# Altium project DiPHO.PrjPcb
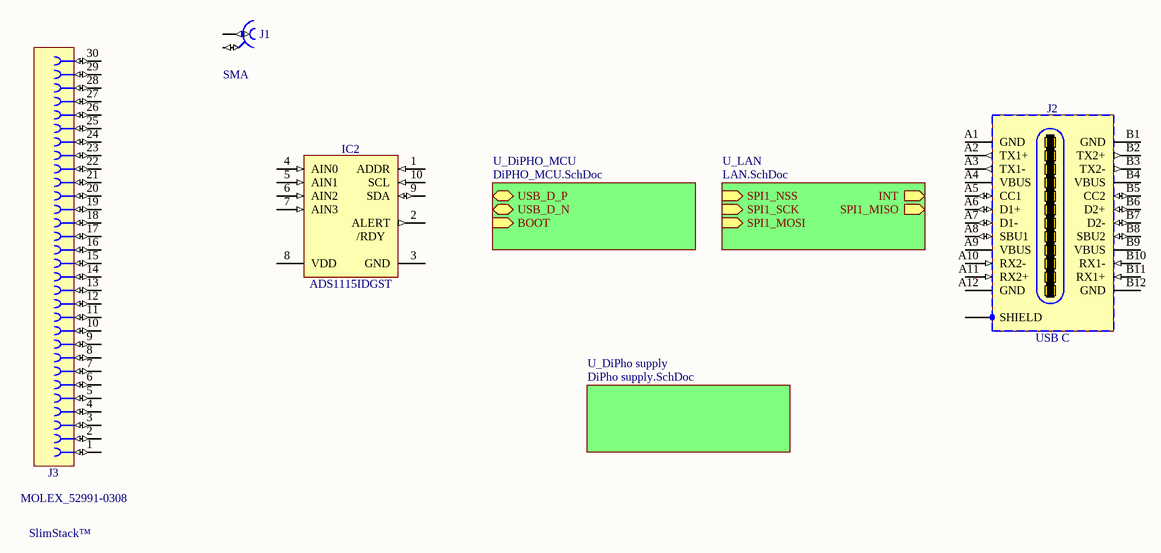
[diagram p0: DiPho_main.SchDoc]
4 sheets, 59 parts. Net scope: hierarchical (ports join the sheet entries above them; power ports are global).
Board file: DiPho.PcbDoc
Sheets:
  DiPho_main.SchDoc
    U_DiPHO_MCU = DiPHO_MCU.SchDoc
    U_LAN = LAN.SchDoc
    U_DiPho supply = DiPho supply.SchDoc

## Sheet DiPho_main.SchDoc
size A4

### Parts
IC2  ADS1115IDGST  [SOP50P490X110-10N]
J1  SMA  [AMPHENOL_132134]
J2  USB C  [AMPHENOL_10132328-10011LF]
J3  SlimStack™  [MOLEX_52991-0308]

### Sub-sheets
U_DiPho supply = DiPho supply.SchDoc: no entries
U_DiPHO_MCU = DiPHO_MCU.SchDoc: USB_D_P (bidir), USB_D_N (bidir), BOOT (in)
U_LAN = LAN.SchDoc: INT (out), SPI1_NSS (in), SPI1_SCK (in), SPI1_MOSI (in), SPI1_MISO (out)

### Nets

Not connected (* = marked no-connect by the designer): IC2 1(ADDR) 2(ALERT) 3(GND) 4(AIN0) 5(AIN1) 6(AIN2) 7(AIN3) 8(VDD) 9(SDA) 10(SCL); J1 1 2; J2 A1(GND) A2(TX1+) A3(TX1-) A4(VBUS) A5(CC1) A6(D1+) A7(D1-) A8(SBU1) A9(VBUS) A10(RX2-) A11(RX2+) A12(GND) B1(GND) B2(TX2+) B3(TX2-) B4(VBUS) B5(CC2) B6(D2+) B7(D2-) B8(SBU2) B9(VBUS) B10(RX1-) B11(RX1+) B12(GND) SHIELD; J3 1 2 3 4 5 6 7 8 9 10 11 12 13 14 15 16 17 18 19 20 21 22 23 24 25 26 27 28 29 30

### Notes on the sheet
- (in symbol ADS1115IDGST) /RDY

### Library data of the parts
IC2 = ADS1115IDGST: Ultra-Small, Low-Power, 16-Bit Analog-to-Digital Converter with Internal Reference; Part Description: Ultra-Small, Low-Power, 4 Channels 16-Bit Analog-to-Digital Converter with Internal Reference; Manufacturer: TEXAS INSTRUMENTS; PressFit: No; Bonding: No; Part Number: ADS1115IDGST; Component Kind: Standard; Component Type: Standard; Device: ADS1115IDGST; PackageDescription: SOP, 0.50mm Pitch; 10 Pin, 3.00mm W X 3.00mm L X 1.10mm H body, IPC Medium Density; Manufacturer Part Number: ADS1115IDGST; Pin Count: 10; Case: MSOP10; Mounted: Yes; Socket: No; SMD: Yes; Sense: No; ComponentHeight: 1.1mm; Author: CERN DEM JLC; HelpURL: \\cern.ch\dfs\Applications\Altium\Datasheets\ADS1115IDGST.pdf; CreateDate: 29.10.2012; LatestRevisionDate: 29.10.2012
J1 = AMPHENOL_132134: Part Description: 50 Ohm Through Hole SMA Straight PCB Jack; Manufacturer Part Number: 132134; PressFit: No; Part Number: AMPHENOL_132134; Component Kind: Standard; Component Type: Standard; Pin Count: 4; Family: SMA; Mounted: Yes; Socket: No; SMD: No; Sense: No; Status: None; Manufacturer: AMPHENOL; ComponentHeight: 9.53mm; HelpURL: \\cern.ch\dfs\Applications\Altium\Datasheets\AMPHENOL_132134.pdf; Author: CERN DEM JLC; CreateDate: 16.12.2013; LatestRevisionDate: 16.12.2013
J2 = AMPHENOL_10132328-10011LF: 2x12 Pin + 1 Shield  USB Type C Receptacle; Part Description: 1 Port Vertical Receptacle 24 Contacts, USB Type C Input Output Connector; PressFit: No; Part Number: AMPHENOL_10132328-10011LF; Component Kind: Standard; Component Type: Standard; Pin Count: 34; Family: USB C; Mounted: Yes; Socket: No; SMD: Yes; Sense: No; Status: None; Manufacturer: AMPHENOL; Manufacturer Part Number: 10132328-10011LF; ComponentHeight: 8.8mm; HelpURL: \\cern.ch\dfs\Applications\Altium\Datasheets\AMPHENOL_10132328-10011LF.pdf; Author: CERN DEM BC; CreateDate: 23.10.2020; LatestRevisionDate: 23.10.2020
J3 = MOLEX_52991-0308: Connector 30 Female; Part Description: 0.50mm Pitch SlimStack™ Dual Row 30 Circuits Surface Mount Vertical Receptacle (3.00 and 4.00mm Stacking Heights); Manufacturer: MOLEX; PressFit: No; Part Number: MOLEX_52991-0308; Component Kind: Standard; Component Type: Standard; Pin Count: 30; Family: SlimStack™; Mounted: Yes; Socket: No; SMD: Yes; Sense: No; Status: None; Manufacturer Part Number: 52991-0308; ComponentHeight: 2.27mm; HelpURL: \\cern.ch\dfs\Applications\Altium\Datasheets\MOLEX_52991-0308.pdf; Author: CERN DEM JLC; CreateDate: 28.08.2012; LatestRevisionDate: 28.08.2012

## Sheet DiPHO_MCU.SchDoc
size A3
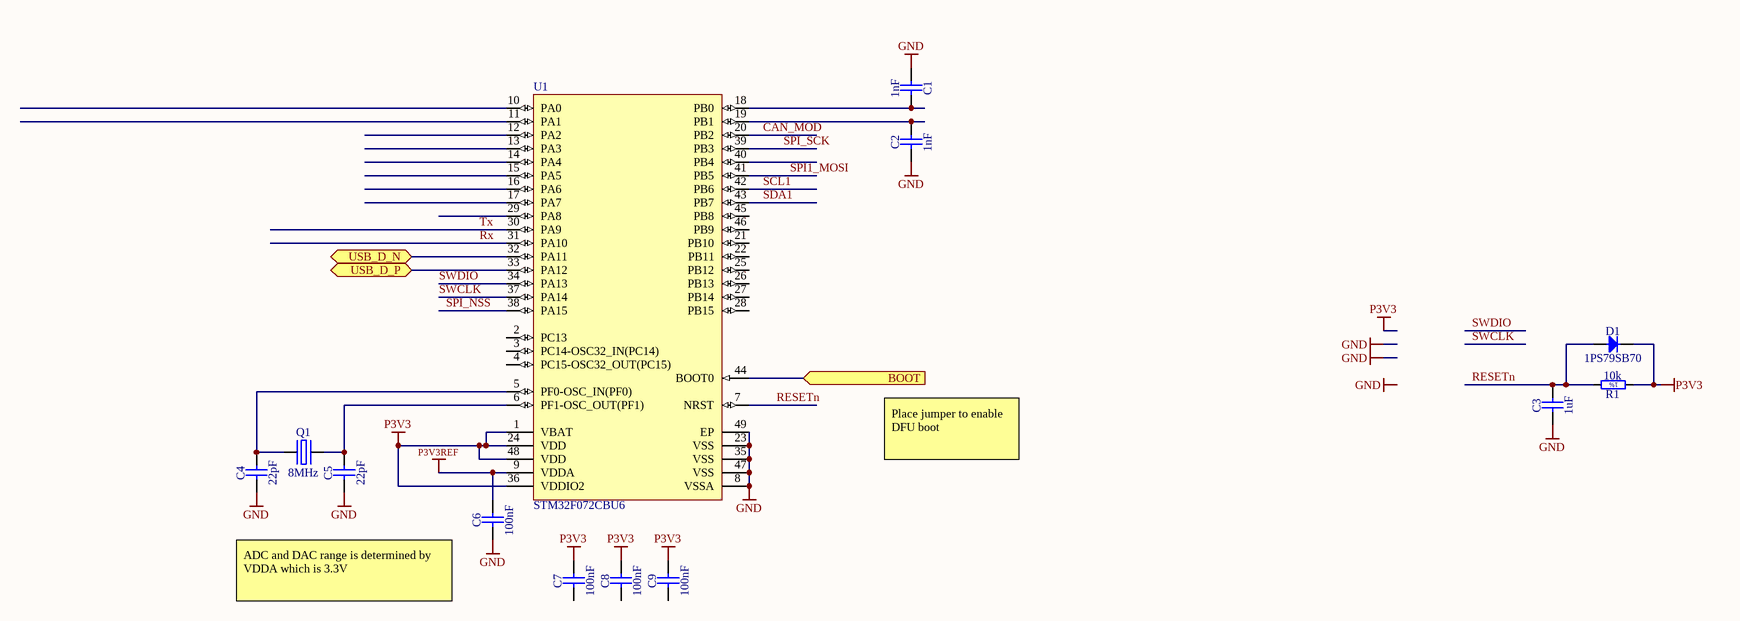
[diagram p1: DiPHO_MCU.SchDoc]

### Parts
C1  1nF  [CAPC1005X55N]
C2  1nF  [CAPC1005X55N]
C3  1uF  [CAPC1608X87N]
C4  22pF  [CAPC1005X55N]
C5  22pF  [CAPC1005X55N]
C6  100nF  [CAPC1005X55N]
C7  100nF  [CAPC1005X55N]
C8  100nF  [CAPC1005X55N]
C9  100nF  [CAPC1005X55N]
D1  1PS79SB70  [SODFL1608X65N]
Q1  8MHz  [XTAL_TXC_7A]
R1  10k  [RESC1005X40N]
U1  STM32F072CBU6  [STM-UFQFPN48_L]

### Ports
BOOT (in), USB_D_N (bidir), USB_D_P (bidir)

### Nets
GND: C1.1 C2.1 C3.1 C4.1 C5.1 C6.1 U1.8(VSSA) U1.23(VSS) U1.35(VSS) U1.47(VSS) U1.49(EP)
P3V3: C7.2 C8.2 C9.2 D1.1(C) R1.1 U1.1(VBAT) U1.24(VDD) U1.36(VDDIO2) U1.48(VDD)
P3V3REF: C6.2 U1.9(VDDA)
CAN_MOD: U1.20(PB2)
RESETn: C3.2 D1.2(A) R1.2 U1.7(NRST)
Rx: U1.31(PA10)
SCL1: U1.42(PB6)
SDA1: U1.43(PB7)
SPI1_MOSI: U1.41(PB5)
SPI_NSS: U1.38(PA15)
SPI_SCK: U1.39(PB3)
SWCLK: U1.37(PA14)
SWDIO: U1.34(PA13)
Tx: U1.30(PA9)
NetC1_2: C1.2 U1.18(PB0)
NetC2_2: C2.2 U1.19(PB1)
NetC4_2: C4.2 Q1.1(OSC1) U1.5(PF0-OSC_IN(PF0))
NetC5_2: C5.2 Q1.2(OSC2) U1.6(PF1-OSC_OUT(PF1))
NetU1_32: U1.32(PA11) ; port USB_D_N
NetU1_33: U1.33(PA12) ; port USB_D_P
NetU1_44: U1.44(BOOT0) ; port BOOT

Not connected (* = marked no-connect by the designer): C7 1; C8 1; C9 1; U1 2(PC13) 3(PC14-OSC32_IN(PC14)) 4(PC15-OSC32_OUT(PC15)) 10(PA0) 11(PA1) 12(PA2) 13(PA3) 14(PA4) 15(PA5) 16(PA6) 17(PA7) 21(PB10) 22(PB11) 25(PB12) 26(PB13) 27(PB14) 28(PB15) 29(PA8) 40(PB4) 45(PB8) 46(PB9)

### Notes on the sheet
- Place jumper to enable DFU boot
- ADC and DAC range is determined by VDDA which is 3.3V
- Labels drawn without touching a wire or pin: GND
- (in symbol R0402_10K_1%_0.0625W_100PPM) 1%

### Library data of the parts
C1 C2 = CC0402_1NF_50V_5%_C0G: Non-polarised capacitor; Part Description: SMD Multilayer Chip Ceramic Capacitor; Manufacturer: GENERIC; Manufacturer1 Part Number: C0402C102J5GACTU; Voltage: 50V; TC: C0G/NP0; Tolerance: ±5%; Part Number: CC0402_1NF_50V_5%_C0G; Component Kind: Standard; Component Type: Standard; Pin Count: 2; Value: 1nF; Status: Preferred; Manufacturer Part Number: CC0402_1NF_50V_5%_C0G; Case: 0402; Mounted: Yes; Socket: No; SMD: Yes; Sense: No; Manufacturer1 Example: KEMET; Manufacturer1 ComponentHeight: 0.55mm; HelpURL: \\cern.ch\dfs\Applications\Altium\Datasheets\CC0402_C0G_KEMET_(Commercial Grade).pdf; Author: CERN DEM BC; CreateDate: 02/09/2019; LatestRevisionDate: 02/09/2019
C3 = CC0603_1UF_16V_10%_X7R: Non-polarised capacitor; Part Description: SMD Multilayer Chip Ceramic Capacitor; Manufacturer: GENERIC; Manufacturer1 Part Number: 223878615663; Voltage: 16V; TC: X7R; Tolerance: ±10%; Part Number: CC0603_1UF_16V_10%_X7R; Component Kind: Standard; Component Type: Standard; Pin Count: 2; Value: 1uF; Status: None; Manufacturer Part Number: CC0603_1uF_16V_10%_X7R; Case: 0603; Mounted: Yes; Socket: No; SMD: Yes; Sense: No; Manufacturer1 Example: YAGEO PHYCOMP; Manufacturer1 ComponentHeight: 0.9mm; HelpURL: \\cern.ch\dfs\Applications\Altium\Datasheets\CC0603_X7R_PHYCOMP.pdf; Author: CERN DEM JLC; CreateDate: 03.12.2007; LatestRevisionDate: 17.04.2015
C4 C5 = CC0402_22PF_50V_5%_C0G: Non-polarised capacitor; Part Description: SMD Multilayer Chip Ceramic Capacitor; Manufacturer: GENERIC; Manufacturer1 Part Number: C0402C220J5GACTU; Voltage: 50V; TC: C0G/NP0; Tolerance: ±5%; Part Number: CC0402_22PF_50V_5%_C0G; Component Kind: Standard; Component Type: Standard; Pin Count: 2; Value: 22pF; Status: Preferred; Manufacturer Part Number: CC0402_22PF_50V_5%_C0G; Case: 0402; Mounted: Yes; Socket: No; SMD: Yes; Sense: No; Manufacturer1 Example: KEMET; Manufacturer1 ComponentHeight: 0.55mm; HelpURL: \\cern.ch\dfs\Applications\Altium\Datasheets\CC0805_C0G_KEMET_(Commercial Grade).pdf; Author: CERN DEM JLC; CreateDate: 03.12.2007; LatestRevisionDate: 03.12.2007
C6-C9 = CC0402_100NF_16V_10%_X7R: Non-polarised capacitor; Part Description: SMD Multilayer Chip Ceramic Capacitor; Manufacturer: GENERIC; Manufacturer1 Part Number: GRM155R71C104KA88D; Voltage: 16V; TC: X7R; Tolerance: ±10%; Part Number: CC0402_100NF_16V_10%_X7R; Component Kind: Standard; Component Type: Standard; Pin Count: 2; Value: 100nF; Status: Not Recommended; Manufacturer Part Number: CC0402_100NF_16V_10%_X7R; Case: 0402; Mounted: Yes; Socket: No; SMD: Yes; Sense: No; Manufacturer1 Example: MURATA; Manufacturer1 ComponentHeight: 0.55mm; HelpURL: \\cern.ch\dfs\Applications\Altium\Datasheets\CC0402_X7R_MURATA_GRM.pdf; Author: CERN DEM JLC; CreateDate: 05.12.2013; LatestRevisionDate: 03.12.2007
D1 = D_1PS79SB70: Diode; Part Description: High-speed switching diode; Manufacturer: NEXPERIA; Voltage: 70V; Power: 70mA; PressFit: No; Bonding: No; Part Number: 1PS79SB70; Component Kind: Standard; Component Type: Standard; Device: 1PS79SB70; PackageDescription: Ultra Small Outline Diode Flat Lead (SOD-523), Body; 1.2mm L X 0.8mm W X 0.65mm H, IPC Medium Density; Manufacturer Part Number: 1PS79SB70; Pin Count: 2; Case: SOD523; Mounted: Yes; Socket: No; SMD: Yes; Sense: No; ComponentHeight: 0.65mm; HelpURL: \\cern.ch\dfs\Applications\Altium\Datasheets\BAS516.pdf; Author: GK; CreateDate: 11/09/2018; LatestRevisionDate: 11/09/2018
Q1 = XTAL_8MHZ_TXC_7A-8.000MAAE-T: Quartz Crystal; Part Description: Tolerance: ±30ppm, Stability: ±30ppm, -20°C to +70°C, 12pF, SMD Glass Seam Sealing Crystal, 7A Series; Manufacturer: TXC CORPORATION; PressFit: No; Bonding: No; Part Number: XTAL_8MHZ_TXC_7A-8.000MAAE-T; Component Kind: Standard; Component Type: Standard; PackageDescription: 2 Pins, 3.2x5mm, SMD Glass Seam Sealing Crystal, 7A Serie; Value: 8MHz; Manufacturer Part Number: 7A-8.000MAAE-T; Pin Count: 2; Mounted: Yes; Socket: No; SMD: Yes; Sense: No; ComponentHeight: 1.2mm; HelpURL: \\cern.ch\dfs\Applications\Altium\Datasheets\XTAL_TXC_7A.pdf; Author: CERN DEM JLC; CreateDate: 09.10.2014; LatestRevisionDate: 12.11.2014
R1 = R0402_10K_1%_0.0625W_100PPM: Resistor - 1%; Part Description: General Purpose Thick Film Chip Resistor; Manufacturer: GENERIC; Manufacturer1 Part Number: 232270671003L; TC: ±100ppm/°C; PressFit: No; Part Number: R0402_10K_1%_0.0625W_100PPM; Component Kind: Standard; Component Type: Standard; Pin Count: 2; Value: 10k; Status: Not Recommended; Power: 0.0625W; Tolerance: ±1%; Manufacturer Part Number: R0402_10K_1%_0.0625W_100PPM; Case: 0402; Mounted: Yes; Sense: No; Socket: No; SMD: Yes; Manufacturer1 Example: YAGEO PHYCOMP; Manufacturer1 ComponentHeight: 0.4mm; HelpURL: \\cern.ch\dfs\Applications\Altium\Datasheets\R0402_Phycomp_RC0402.pdf; Author: CERN DEM JLC; CreateDate: 03.12.2007; LatestRevisionDate: 17.10.2012
U1 = CMP-0304-00173-2: ARM Cortex-M0 32-bit MCU, 128 KB Flash, 16 KB Internal RAM, 37 I/Os, 48-Pin UFQFPN, -40 to 85 degC, Tray; Manufacturer: STMicroelectronics; I/Os (High Current): 37; FLASH Size (Prog) (kB): 128; Supply Voltage(Vcc) min (V): 2; Internal RAM Size (kB): 16; D/A Converter: 1; Operating Frequency(F) (Processor speed) (MHz): 48; Package Reference: UFQFPN48; ComponentLink2Description: Datasheet; ComponentLink2URL: http://www.st.com/st-web-ui/static/active/en/resource/technical/document/datasheet/DM00090510.pdf; Package Description: 48-Pin Ultra Thin Fine Pitch Quad Flat No-Lead, 7 x 7 x 0.6 mm Body, 0.5 mm Pitch, Exposed Pad; Mounting Technology: Surface Mount; Packing: Tray; ComponentLink1URL: http://www.st.com/; ComponentLink1Description: Manufacturer URL; DatasheetVersion: Rev. 5; PartNumber: STM32F072CBU6; Core: ARM Cortex-M0

## Sheet LAN.SchDoc
size A4
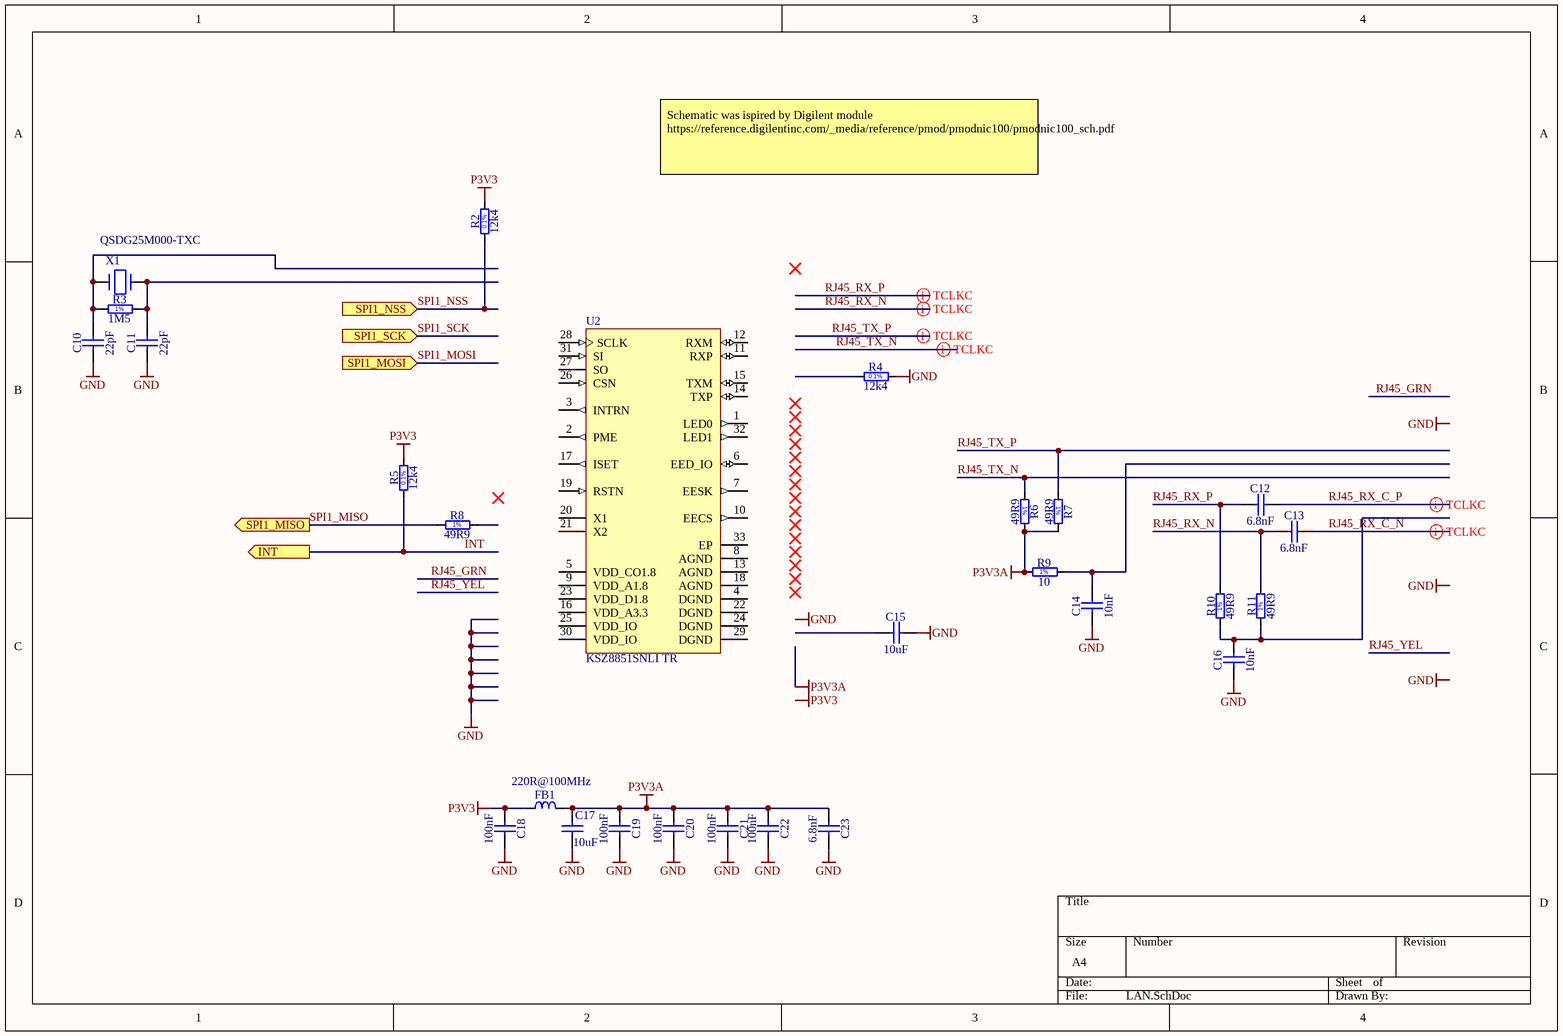
[diagram p2: LAN.SchDoc]

### Parts
C10  22pF  [CAPC1005X55N]
C11  22pF  [CAPC1005X55N]
C12  6.8nF  [CAPC1608X87N]
C13  6.8nF  [CAPC1608X87N]
C14  10nF  [CAPC1608X87N]
C15  10uF  [CAPC1608X80N]
C16  10nF  [CAPC1608X87N]
C17  10uF  [CAPC2012X135N]
C18  100nF  [CAPC1005X55N]
C19  100nF  [CAPC1005X55N]
C20  100nF  [CAPC1005X55N]
C21  100nF  [CAPC1005X55N]
C22  100nF  [CAPC1005X55N]
C23  6.8nF  [CAPC1608X87N]
FB1  220R@100MHz  [INDC2012X105N]
R2  12k4  [RESC1608X55N]
R3  1M5  [RESC1005X40N]
R4  12k4  [RESC1608X55N]
R5  12k4  [RESC1608X55N]
R6  49R9  [RESC1005X40N]
R7  49R9  [RESC1005X40N]
R8  49R9  [RESC1005X40N]
R9  10  [RESC1005X40N]
R10  49R9  [RESC1005X40N]
R11  49R9  [RESC1005X40N]
U2  KSZ8851SNLI TR  [MCHP-MLF-32_L]
X1  QSDG25M000-TXC  [XTAL_5.0*3.2]

### Ports
INT (out), SPI1_MISO (out), SPI1_MOSI (in), SPI1_NSS (in), SPI1_SCK (in)

### Nets
GND: C10.1 C11.1 C14.1 C15.2 C16.1 C17.2 C18.2 C19.2 C20.2 C21.2 C22.2 C23.2 R4.2
P3V3: C18.1 FB1.1 R2.2 R5.2
P3V3A: C17.1 C19.1 C20.1 C21.1 C22.1 C23.1 FB1.2 R6.2 R7.2 R9.1
INT: R5.1 ; port INT
RJ45_RX_C_N: C13.2
RJ45_RX_C_P: C12.2
RJ45_RX_N: C13.1 R11.2
RJ45_RX_P: C12.1 R10.2
RJ45_TX_N: R6.1
RJ45_TX_P: R7.1
SPI1_MISO: R8.1 ; port SPI1_MISO
SPI1_MOSI: port SPI1_MOSI
SPI1_NSS: R2.1 ; port SPI1_NSS
SPI1_SCK: port SPI1_SCK
NetC10_2: C10.2 R3.1 X1.1
NetC11_2: C11.2 R3.2 X1.2
NetC14_2: C14.2 R9.2
NetC16_2: C16.2 R10.1 R11.1

Not connected (* = marked no-connect by the designer): C15 1; R4 1; R8 2; U2 1(LED0) 2(PME) 3(INTRN) 4(DGND) 5(VDD_CO1.8) 6(EED_IO) 7(EESK) 8(AGND) 9(VDD_A1.8) 10(EECS) 11(RXP) 12(RXM) 13(AGND) 14(TXP) 15(TXM) 16(VDD_A3.3) 17(ISET) 18(AGND) 19(RSTN) 20(X1) 21(X2) 22(DGND) 23(VDD_D1.8) 24(DGND) 25(VDD_IO) 26(CSN) 27(SO) 28(SCLK) 29(DGND) 30(VDD_IO) 31(SI) 32(LED1) 33(EP)

### Layout directives
differential pair: RJ45_RX_C_N, RJ45_RX_C_P, RJ45_RX_N, RJ45_RX_P, RJ45_TX_N, RJ45_TX_P

### Notes on the sheet
- Schematic was ispired by Digilent module https://reference.digilentinc.com/_media/reference/pmod/pmodnic100/pmodnic100_sch.pdf
- Labels drawn without touching a wire or pin: GND, P3V3
- (in symbol R0402_1M5_1%_0.0625W_100PPM) 1%
- (in symbol R0402_10R_1%_0.0625W_200PPM) 1%
- (in symbol R0402_49R9_1%_0.0625W_100PPM) 1%
- (in symbol R0603_12K4_0.1%_0.063W_10PPM) 0.1%

### Library data of the parts
C10 C11 = CC0402_22PF_50V_5%_NP0: Non-polarised capacitor; Part Description: SMD Multilayer Chip Ceramic Capacitor; Manufacturer: GENERIC; Manufacturer1 Part Number: 223886915229; Voltage: 50V; TC: NP0; Tolerance: ±5%; Table: Capacitors SMD; Part Number: CC0402_22PF_50V_5%_NP0; Component Kind: Standard; Component Type: Standard; Pin Count: 2; Value: 22pF; Status: Not Recommended; Manufacturer Part Number: CC0402_22PF_50V_5%_NP0; Case: 0402; Mounted: Yes; Socket: No; SMD: Yes; Manufacturer1 Example: PHYCOMP; Manufacturer1 ComponentHeight: 0.55mm; HelpURL: \\cern.ch\dfs\Applications\Altium\Datasheets\CC0402_NP0_PHYCOMP.pdf; Author: CERN DEM JLC; CreateDate: 2007-12-03; LatestRevisionDate: 2007-12-03
C12 C13 C23 = CC0603_6.8NF_25V_1%_C0G: Non-polarised capacitor; Part Description: SMD Multilayer Chip Ceramic Capacitor; Manufacturer: GENERIC; Manufacturer1 Part Number: C0603C682F3GACTU; Voltage: 25V; TC: C0G/NP0; Tolerance: ±1%; Part Number: CC0603_6.8NF_25V_1%_C0G; Component Kind: Standard; Component Type: Standard; Pin Count: 2; Value: 6.8nF; Status: None; Manufacturer Part Number: CC0603_6.8NF_25V_1%_C0G; Case: 0603; Mounted: Yes; Socket: No; SMD: Yes; Sense: No; Manufacturer1 Example: KEMET; Manufacturer1 ComponentHeight: 0.87mm; HelpURL: \\cern.ch\dfs\Applications\Altium\Datasheets\CC0603_C0G_KEMET_(Commercial Grade).pdf; Author: CERN DEM JLC; CreateDate: 23/05/2018; LatestRevisionDate: 23/05/2018
C14 C16 = CC0603_10NF_50V_5%_C0G: Non-polarised capacitor; Part Description: SMD Multilayer Chip Ceramic Capacitor; Manufacturer: GENERIC; Manufacturer1 Part Number: C1608C0G1H103J080AA; Voltage: 50V; TC: C0G/NP0; Tolerance: ±5%; Part Number: CC0603_10NF_50V_5%_C0G; Component Kind: Standard; Component Type: Standard; Pin Count: 2; Value: 10nF; Status: Preferred; Manufacturer Part Number: CC0603_10NF_50V_5%_C0G; Case: 0603; Mounted: Yes; Socket: No; SMD: Yes; Sense: No; Manufacturer1 Example: TDK; Manufacturer1 ComponentHeight: 0.9mm; HelpURL: \\cern.ch\dfs\Applications\Altium\Datasheets\CC0603_C0G_TDK_C.pdf; Author: CERN DEM JLC; CreateDate: 10.12.2014; LatestRevisionDate: 10.12.2014
C15 = CC0603_10UF_16V_20%_X5R: Non-polarised capacitor; Part Description: SMD Multilayer Chip Ceramic Capacitor; Manufacturer: GENERIC; Manufacturer1 Part Number: GRM188R61C106MA73D; Voltage: 16V; TC: X5R; Tolerance: ±20%; Part Number: CC0603_10UF_16V_20%_X5R; Component Kind: Standard; Component Type: Standard; Pin Count: 2; Value: 10uF; Status: None; Manufacturer Part Number: CC0603_10UF_16V_20%_X5R; Case: 0603; Mounted: Yes; Socket: No; SMD: Yes; Sense: No; Manufacturer1 Example: MURATA; Manufacturer1 ComponentHeight: 0.8mm; HelpURL: \\cern.ch\dfs\Applications\Altium\Datasheets\CC0603_X5R_MURATA_GRM.pdf; Author: CERN DEM MR; CreateDate: 02/03/2016; LatestRevisionDate: 02/03/2016
C17 = CC0805_10UF_10V_10%_X7R: Non-polarised capacitor; Part Description: SMD Multilayer Chip Ceramic Capacitor; Manufacturer: GENERIC; Manufacturer1 Part Number: GRM21BR71A106KE51L; Voltage: 10V; TC: X7R; Tolerance: ±10%; Table: Capacitors SMD; Part Number: CC0805_10UF_10V_10%_X7R; Component Kind: Standard; Component Type: Standard; Pin Count: 2; Value: 10uF; Status: Preferred; Manufacturer Part Number: CC0805_10UF_10V_10%_X7R; Case: 0805; Mounted: Yes; Socket: No; SMD: Yes; Manufacturer1 Example: MURATA; Manufacturer1 ComponentHeight: 1.35mm; HelpURL: \\cern.ch\dfs\Applications\Altium\Datasheets\CC0805_X7R_MURATA.pdf; Author: CERN DEM JLC; CreateDate: 2012-04-30; LatestRevisionDate: 2012-04-30
C18-C22 = CC0402_100NF_16V_10%_X7R: as C6 on sheet DiPHO_MCU; Part Number: CC0402_100NF_16V_10%_X7R; Component Kind: Standard; Component Type: Standard; Pin Count: 2; Value: 100nF; Status: Not Recommended; Manufacturer Part Number: CC0402_100NF_16V_10%_X7R; Case: 0402; Mounted: Yes; Socket: No; SMD: Yes; Manufacturer1 Example: MURATA; Manufacturer1 ComponentHeight: 0.55mm; HelpURL: \\cern.ch\dfs\Applications\Altium\Datasheets\CC0402_X7R_MURATA_GRM.pdf; Author: CERN DEM JLC; CreateDate: 05.12.2013; LatestRevisionDate: 03.12.2007; Sense: No
FB1 = IND0805_MURATA_BLM21PG221SN1D: Inductor; Part Description: SMD EMIFIL Suppression Chip Ferrite Bead; Manufacturer: MURATA; Power: 2A; Resistance: 0.05R; Tolerance: ±25%; Table: Inductors SMD; Part Number: IND0805_MURATA_BLM21PG221SN1D; Component Kind: Standard; Component Type: Standard; Pin Count: 2; Value: 220R@100MHz; Status: None; Manufacturer Part Number: BLM21PG221SN1D; Case: 0805; Mounted: Yes; Socket: No; SMD: Yes; ComponentHeight: 1.05mm; HelpURL: \\cern.ch\dfs\Applications\Altium\Datasheets\IND0402_MURATA_BLM21P.pdf; Author: CERN DEM JLC; CreateDate: 2010-01-25; LatestRevisionDate: 2010-01-25
R2 R4 R5 = R0603_12K4_0.1%_0.063W_10PPM: Resistor - 0.1%; Part Description: Thin Film Chip Resistor; Manufacturer: GENERIC; Manufacturer1 Part Number: RN73C1J12K4BTDF; Power: 0.063W; TC: ±10ppm; Part Number: R0603_12K4_0.1%_0.063W_10PPM; Component Kind: Standard; Component Type: Standard; Pin Count: 2; Value: 12k4; Status: Not recommended; Tolerance: ±0.1%; Manufacturer Part Number: R0603_12K4_0.1%_0.063W_10PPM; Case: 0603; Mounted: Yes; Sense: No; Socket: No; SMD: Yes; Manufacturer1 Example: TYCO HOLSWORTHY; Manufacturer1 ComponentHeight: 0.5mm; HelpURL: \\cern.ch\dfs\Applications\Altium\Datasheets\R0603_Tyco_RN73.pdf; Author: CERN DEM JLC; CreateDate: 03.12.2007; LatestRevisionDate: 13.03.2008
R3 = R0402_1M5_1%_0.0625W_100PPM: Resistor - 1%; Part Description: General Purpose Thick Film Chip Resistor; Manufacturer: GENERIC; Manufacturer1 Part Number: 232270671505L; TC: ±100ppm/°C; PressFit: No; Part Number: R0402_1M5_1%_0.0625W_100PPM; Component Kind: Standard; Component Type: Standard; Pin Count: 2; Value: 1M5; Status: Not Recommended; Power: 0.0625W; Tolerance: ±1%; Manufacturer Part Number: R0402_1M5_1%_0.0625W_100PPM; Case: 0402; Mounted: Yes; Sense: No; Socket: No; SMD: Yes; Manufacturer1 Example: YAGEO PHYCOMP; Manufacturer1 ComponentHeight: 0.4mm; HelpURL: \\cern.ch\dfs\Applications\Altium\Datasheets\R0402_Phycomp_RC0402.pdf; Author: CERN DEM JLC; CreateDate: 03/12/2007; LatestRevisionDate: 17/10/2012
R6-R8 R10 R11 = R0402_49R9_1%_0.0625W_100PPM: Resistor - 1%; Part Description: General Purpose Thick Film Chip Resistor; Manufacturer: GENERIC; Manufacturer1 Part Number: 232270674999L or RC0402FR-0749R9L; TC: ±100ppm/°C; Table: Resistors SMD; Part Number: R0402_49R9_1%_0.0625W_100PPM; Component Kind: Standard; Component Type: Standard; Pin Count: 2; Value: 49R9; Status: Not recommended; Power: 0.0625W; Tolerance: ±1%; Manufacturer Part Number: R0402_49R9_1%_0.0625W_100PPM; Case: 0402; Mounted: Yes; Socket: No; SMD: Yes; Manufacturer1 Example: YAGEO PHYCOMP; Manufacturer1 ComponentHeight: 0.4mm; HelpURL: \\cern.ch\dfs\Applications\Altium\Datasheets\R0402_Phycomp_RC0402.pdf; Author: CERN DEM JLC; CreateDate: 2012-10-24; LatestRevisionDate: 2012-10-24
R9 = R0402_10R_1%_0.0625W_200PPM: Resistor - 1%; Part Description: General Purpose Thick Film Chip Resistor; Manufacturer: GENERIC; Manufacturer1 Part Number: 232270671009L; TC: ±200ppm/°C; Part Number: R0402_10R_1%_0.0625W_200PPM; Component Kind: Standard; Component Type: Standard; Pin Count: 2; Value: 10; Status: Not recommended; Power: 0.0625W; Tolerance: ±1%; Manufacturer Part Number: R0402_10R_1%_0.0625W_200PPM; Case: 0402; Mounted: Yes; Sense: No; Socket: No; SMD: Yes; Manufacturer1 Example: YAGEO PHYCOMP; Manufacturer1 ComponentHeight: 0.4mm; HelpURL: \\cern.ch\dfs\Applications\Altium\Datasheets\R0402_Phycomp_RC0402.pdf; Author: CERN DEM JLC; CreateDate: 24.06.2009; LatestRevisionDate: 17.10.2012
U2 = CMP-2000-06522-1: Single-Port Ethernet Controller with SPI Interface, 3.1 to 3.5 V, -40 to 85 degC, 32-Pin MLF, RoHS, Tape and Reel; Manufacturer: Micrel; Protocol Supported: 802.3; Number of Transceivers: 1Transceiver; Data Rate: 100Mbps; Maximum Supply Current: 85mA; Supply Voltage - Min: 3.1V; Ethernet Connection Type: 10/100Base-TX; Supply Voltage - Max: 3.5V; Package Description: 32-Pin Quad Flat No-lead Package, Body 5 x 5 mm, Thermal Pad 3.1 x 3.1 mm, Pitch 0.5 mm; Mounting Style: SMD/SMT; Series: KSZ8851; Manufacturer URL: http://www.microchip.com/; Minimum Operating Temperature: -40C; Packaging: Reel; Package Reference: MLF-32; Package / Case: MLF-32; Datasheet Version: 11/2016; Mounting Technology: SurfaceMount; Datasheet URL: http://ww1.microchip.com/downloads/en/DeviceDoc/00002381A.pdf; Product Category: EthernetICs; Maximum Operating Temperature: +85C; Product: EthernetControllers; RoHS: Details; Brand: Micrel; Factory Pack Quantity: 1000
X1 = X_CRYSTAL_SMD_5.0*3.2: miniature crystal oscillator (Maritex)

## Sheet DiPho supply.SchDoc
size A4
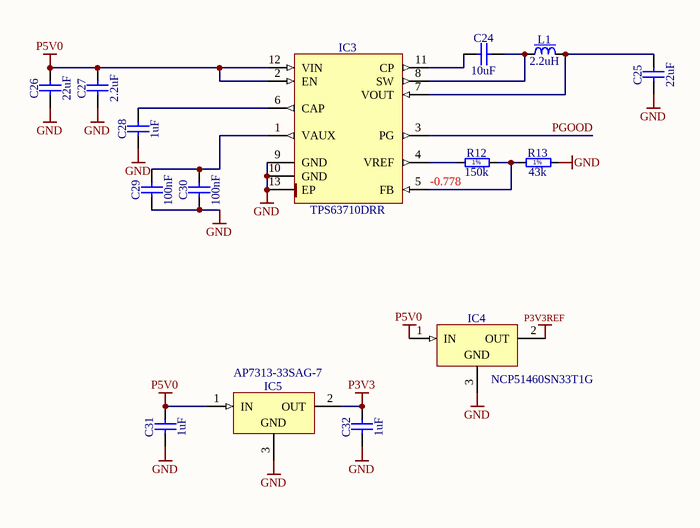
[diagram p3: DiPho supply.SchDoc]

### Parts
C24  10uF  [CAPC2012X135N]
C25  22uF  [CAPC2012X135N]
C26  22uF  [CAPC2012X135N]
C27  2.2uF  [CAPC1608X87N]
C28  1uF  [CAPC1608X87N]
C29  100nF  [CAPC1005X55N]
C30  100nF  [CAPC1005X55N]
C31  1uF  [CAPC1608X87N]
C32  1uF  [CAPC1608X87N]
IC3  TPS63710DRR  [SON50P300X300X80-13N-R160X260]
IC4  NCP51460SN33T1G  [SOT95P240X110-3N]
IC5  AP7313-33SAG-7  [SOT95P240X130-3N]
L1  2.2uH  [INDM3225X210N]
R12  150k  [RESC1005X40N]
R13  43k  [RESC1005X40N]

### Nets
GND: C25.1 C26.1 C27.1 C28.1 C29.1 C30.1 C31.1 C32.1 IC3.9(GND) IC3.10(GND) IC3.13(EP) IC4.3(GND) IC5.3(GND) R13.2
P3V3: C32.2 IC5.2(OUT)
P3V3REF: IC4.2(OUT)
P5V0: C26.2 C27.2 C31.2 IC3.2(EN) IC3.12(VIN) IC4.1(IN) IC5.1(IN)
PGOOD: IC3.3(PG)
NetC24_1: C24.1 IC3.11(CP)
NetC24_2: C24.2 IC3.8(SW) L1.1
NetC25_2: C25.2 IC3.7(VOUT) L1.2
NetC28_2: C28.2 IC3.6(CAP)
NetC29_2: C29.2 C30.2 IC3.1(VAUX)
NetIC3_4: IC3.4(VREF) R12.1
NetIC3_5: IC3.5(FB) R12.2 R13.1

### Notes on the sheet
- (near R12) -0.778
- (in symbol R0402_43K_1%_0.0625W_100PPM) 1%
- (in symbol R0402_150K_1%_0.0625W_100PPM) 1%

### Library data of the parts
C24 = CC0805_10UF_16V_10%_X5R: Non-polarised capacitor; Part Description: SMD Multilayer Chip Ceramic Capacitor; Manufacturer: GENERIC; Manufacturer1 Part Number: C0805C106K4PAC; Voltage: 16V; TC: X5R; Tolerance: ±10%; Part Number: CC0805_10UF_16V_10%_X5R; Component Kind: Standard; Component Type: Standard; Pin Count: 2; Value: 10uF; Status: Preferred; Manufacturer Part Number: CC0805_10UF_16V_10%_X5R; Case: 0805; Mounted: Yes; Socket: No; SMD: Yes; Sense: No; Manufacturer1 Example: KEMET; Manufacturer1 ComponentHeight: 1.4mm; HelpURL: \\cern.ch\dfs\Applications\Altium\Datasheets\CC1206_X5R_KEMET.pdf; Author: CERN DEM JLC; CreateDate: 03.12.2007; LatestRevisionDate: 03.12.2007
C25 C26 = CC0805_22UF_16V_10%_X5R: Non-polarised capacitor; Part Description: SMD Multilayer Chip Ceramic Capacitor; Manufacturer: GENERIC; Manufacturer1 Part Number: C2012X5R1C226KT; Voltage: 16V; TC: X5R; Tolerance: ±10%; Part Number: CC0805_22UF_16V_10%_X5R; Component Kind: Standard; Component Type: Standard; Pin Count: 2; Value: 22uF; Status: Preferred; Manufacturer Part Number: CC0805_22UF_16V_10%_X5R; Case: 0805; Mounted: Yes; Socket: No; SMD: Yes; Sense: No; Manufacturer1 Example: TDK; Manufacturer1 ComponentHeight: 1.35mm; HelpURL: \\cern.ch\dfs\Applications\Altium\Datasheets\CC0805_X5R_TDK_C.pdf; Author: CERN DEM JLC; CreateDate: 25.10.2012; LatestRevisionDate: 25.10.2012
C27 = CC0603_2.2UF_16V_10%_X5R: Non-polarised capacitor; Part Description: SMD Multilayer Chip Ceramic Capacitor; Manufacturer: GENERIC; Manufacturer1 Part Number: CC0603KRX5R7BB225; Voltage: 16V; TC: X5R; Tolerance: ±10%; Part Number: CC0603_2.2UF_16V_10%_X5R; Component Kind: Standard; Component Type: Standard; Pin Count: 2; Value: 2.2uF; Status: Preferred; Manufacturer Part Number: CC0603_2.2UF_16V_10%_X5R; Case: 0603; Mounted: Yes; Socket: No; SMD: Yes; Sense: No; Manufacturer1 Example: YAGEO; Manufacturer1 ComponentHeight: 0.9mm; HelpURL: \\cern.ch\dfs\Applications\Altium\Datasheets\CC0805_X5R_PHYCOMP_HC.pdf; Author: CERN DEM JLC; CreateDate: 28.04.2011; LatestRevisionDate: 28.04.2011
C28 C31 C32 = CC0603_1UF_16V_10%_X7R: as C3 on sheet DiPHO_MCU; Part Number: CC0603_1UF_16V_10%_X7R; Component Kind: Standard; Component Type: Standard; Pin Count: 2; Value: 1uF; Status: None; Manufacturer Part Number: CC0603_1uF_16V_10%_X7R; Case: 0603; Mounted: Yes; Socket: No; SMD: Yes; Sense: No; Manufacturer1 Example: YAGEO PHYCOMP; Manufacturer1 ComponentHeight: 0.9mm; HelpURL: \\cern.ch\dfs\Applications\Altium\Datasheets\CC0603_X7R_PHYCOMP.pdf; Author: CERN DEM JLC; CreateDate: 03.12.2007; LatestRevisionDate: 17.04.2015
C29 C30 = CC0402_100NF_16V_10%_X5R: Non-polarised capacitor; Part Description: SMD Multilayer Chip Ceramic Capacitor; Manufacturer: GENERIC; Manufacturer1 Part Number: GRM155R61C104KA88D; Voltage: 16V; TC: X5R; Tolerance: ±10%; Part Number: CC0402_100NF_16V_10%_X5R; Component Kind: Standard; Component Type: Standard; Pin Count: 2; Value: 100nF; Status: None; Manufacturer Part Number: CC0402_100NF_16V_10%_X5R; Case: 0402; Mounted: Yes; Socket: No; SMD: Yes; Sense: No; Manufacturer1 Example: MURATA; Manufacturer1 ComponentHeight: 0.55mm; HelpURL: \\cern.ch\dfs\Applications\Altium\Datasheets\CC0402_X5R_MURATA_GRM.pdf; Author: CERN DEM JLC; CreateDate: 10.12.2013; LatestRevisionDate: 10.12.2013
IC3 = TPS63710DRR: -1 to -5.5VDC, 1A Output, Low Noise Synchronous Inverting Buck Converter; Manufacturer: TEXAS INSTRUMENTS; PressFit: No; Bonding: No; Part Number: TPS63710DRR; Component Kind: Standard; Component Type: Standard; Device: TPS63710DRR; PackageDescription: SON, 0.50mm Pitch, 12-Pin, 3.00mm W  X 3.00mm L X 0.80mm Height, (w/Thermal Tab 1.6 X 2.6 mm), IPC Medium Density; Part Description: -1 to -5.5VDC, 1A Output, Low Noise Synchronous Inverting Buck Converter; Manufacturer Part Number: TPS63710DRR; Pin Count: 13; Case: SON12; Mounted: Yes; Socket: No; SMD: Yes; Sense: No; ComponentHeight: 0.8mm; HelpURL: \\cern.ch\dfs\Applications\Altium\Datasheets\TPS63710DRR.pdf; Author: CERN DEM BC; CreateDate: 11.02.2019; LatestRevisionDate: 11.02.2019
IC4 = NCP51460SN33T1G: 3-Terminal Regulator 1=IN 2=OUT 3=GND; Part Description: 3.3V, 20mA Micropower Precision Voltage Reference; Manufacturer: ON SEMICONDUCTOR; PressFit: No; Bonding: No; Part Number: NCP51460SN33T1G; Component Kind: Standard; Component Type: Standard; Device: NCP51460SN33T1G; PackageDescription: SOT23 3-Leads, Pitch 0.95mm - Body 1.4x3mm, IPC Medium Density; Manufacturer Part Number: NCP51460SN33T1G; Pin Count: 3; Case: SOT23; Mounted: Yes; Socket: No; SMD: Yes; Sense: No; ComponentHeight: 1.1mm; HelpURL: \\cern.ch\dfs\Applications\Altium\Datasheets\NCP51460SN33T1G.pdf; Author: CERN DEM MR; CreateDate: 05.10.2016; LatestRevisionDate: 05.10.2016
IC5 = AP7313-33SAG-7: 3-Terminal Regulator 1=IN 2=OUT 3=GND; Part Description: 3.3V, 150mA Low Quiescent Current, Fast Transient Low Dropout Linear Regulator; Manufacturer: DIODES INCORPORATED; PressFit: No; Bonding: No; Part Number: AP7313-33SAG-7; Component Kind: Standard; Component Type: Standard; Device: AP7313-33SAG-7; PackageDescription: SOT23 3-Leads, Pitch 0.95mm - Body 1.3x2.9mm, IPC Medium Density; Manufacturer Part Number: AP7313-33SAG-7; Pin Count: 3; Case: SOT23; Mounted: Yes; Socket: No; SMD: Yes; Sense: No; ComponentHeight: 1.35mm; HelpURL: \\cern.ch\dfs\Applications\Altium\Datasheets\AP7313-33SAG-7.pdf; Author: CERN DEM JLC; CreateDate: 20.03.2018; LatestRevisionDate: 20.03.2018
L1 = IND1210_2.2UH_10%_EPCOS_B82422A: Inductor With Core; Part Description: SMT Inductor SIMID Series; Manufacturer: EPCOS; Manufacturer Part Number: B82422A1222K100; Power: 270mA; Resistance: 0.75R; Tolerance: ±10%; Part Number: IND1210_2.2UH_10%_EPCOS_B82422A; Component Kind: Standard; Component Type: Standard; Pin Count: 2; Value: 2.2uH; Status: None; Case: 1210; Mounted: Yes; Socket: No; SMD: Yes; Sense: No; ComponentHeight: 2.1mm; HelpURL: \\cern.ch\dfs\Applications\Altium\Datasheets\IND1210_EPCOS_B82422A.pdf; Author: CERN DEM JLC; CreateDate: 01.03.2010; LatestRevisionDate: 01.03.2010
R12 = R0402_150K_1%_0.0625W_100PPM: Resistor - 1%; Part Description: General Purpose Thick Film Chip Resistor; Manufacturer: GENERIC; Manufacturer1 Part Number: 232270671504L; TC: ±100ppm/°C; PressFit: No; Part Number: R0402_150K_1%_0.0625W_100PPM; Component Kind: Standard; Component Type: Standard; Pin Count: 2; Value: 150k; Status: Not Recommended; Power: 0.0625W; Tolerance: ±1%; Manufacturer Part Number: R0402_150K_1%_0.0625W_100PPM; Case: 0402; Mounted: Yes; Sense: No; Socket: No; SMD: Yes; Manufacturer1 Example: YAGEO PHYCOMP; Manufacturer1 ComponentHeight: 0.4mm; HelpURL: \\cern.ch\dfs\Applications\Altium\Datasheets\R0402_Phycomp_RC0402.pdf; Author: CERN DEM JLC; CreateDate: 03/12/2007; LatestRevisionDate: 17/10/2012
R13 = R0402_43K_1%_0.0625W_100PPM: Resistor - 1%; Part Description: General Purpose Thick Film Chip Resistor; Manufacturer: GENERIC; Manufacturer1 Part Number: 232270674303L; TC: ±100ppm/°C; PressFit: No; Part Number: R0402_43K_1%_0.0625W_100PPM; Component Kind: Standard; Component Type: Standard; Pin Count: 2; Value: 43k; Status: Not Recommended; Power: 0.0625W; Tolerance: ±1%; Manufacturer Part Number: R0402_43K_1%_0.0625W_100PPM; Case: 0402; Mounted: Yes; Sense: No; Socket: No; SMD: Yes; Manufacturer1 Example: YAGEO PHYCOMP; Manufacturer1 ComponentHeight: 0.4mm; HelpURL: \\cern.ch\dfs\Applications\Altium\Datasheets\R0402_Phycomp_RC0402.pdf; Author: CERN DEM JLC; CreateDate: 03/12/2007; LatestRevisionDate: 17/10/2012

## Nets that join several sheets
GND: DiPHO_MCU (11 pins), LAN (13 pins), DiPho supply (14 pins)
P3V3: DiPHO_MCU (9 pins), LAN (C18.1 FB1.1 R2.2 R5.2), DiPho supply (C32.2 IC5.2)
P3V3REF: DiPHO_MCU (C6.2 U1.9), DiPho supply (IC4.2)